# Altium schematic sheet Illustrations.SchDoc: Illustrations
size A3; ApprovedBy: LD Stanton; Author: LD Stanton; CompanyName: University of Cape Town; DrawnBy: Lawrence Stanton; Engineer: Lawrence Stanton; Organization: University of Cape Town; Address1: Department of Electrical Engineering; Address2: Rondebosch; Address3: Cape Town; Address4: South Africa 7701; DocumentNumber: 1; SheetNumber: 1; SheetTotal: 1
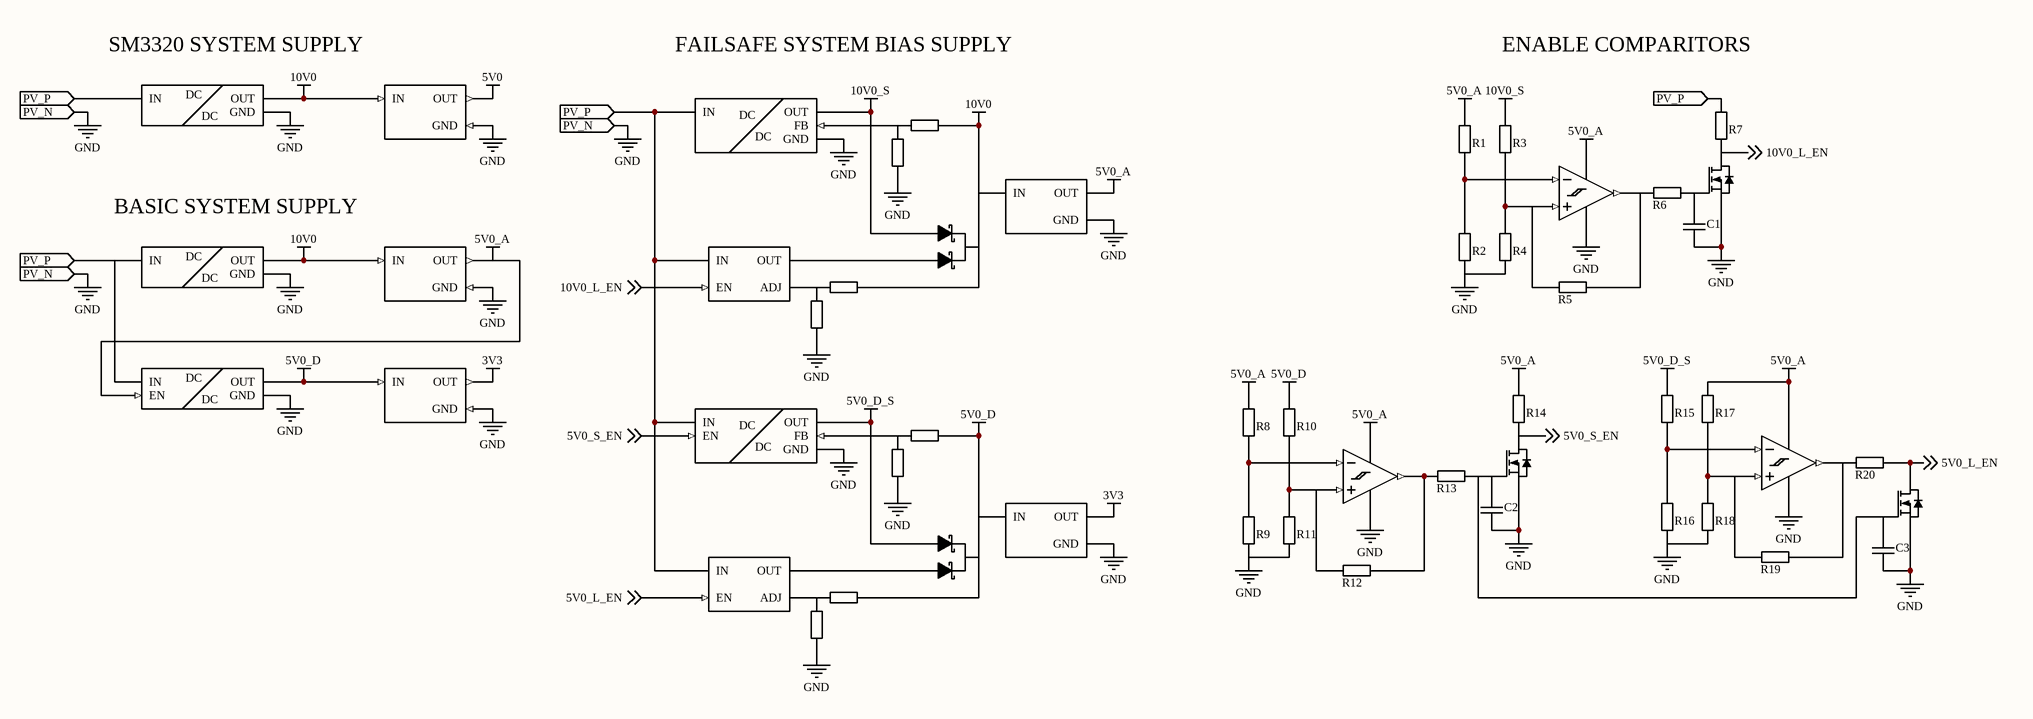
[diagram p0: Illustrations.SchDoc]

## Parts
(Parts that share a designator on the sheet are numbered #1, #2 ... from top to bottom, then left to right.)
C1  Capacitor Non-Polarised Illustration  (value not drawn)  (graphical)
C2  Capacitor Non-Polarised Illustration  (value not drawn)  (graphical)
C3  Capacitor Non-Polarised Illustration  (value not drawn)  (graphical)
D?#1  Schottky Dual Common Cathode Illustration  (value not drawn)  (graphical)
D?#2  Schottky Dual Common Cathode Illustration  (value not drawn)  (graphical)
Q?#1  MOSFET N-Channel Illustration  (value not drawn)  (graphical)
Q?#2  MOSFET N-Channel Illustration  (value not drawn)  (graphical)
Q?#3  MOSFET N-Channel Illustration  (value not drawn)  (graphical)
R1  Resistor Box Illustration  (value not drawn)  (graphical)
R2  Resistor Box Illustration  (value not drawn)  (graphical)
R3  Resistor Box Illustration  (value not drawn)  (graphical)
R4  Resistor Box Illustration  (value not drawn)  (graphical)
R5  Resistor Box Illustration  (value not drawn)  (graphical)
R6  Resistor Box Illustration  (value not drawn)  (graphical)
R7  Resistor Box Illustration  (value not drawn)  (graphical)
R8  Resistor Box Illustration  (value not drawn)  (graphical)
R9  Resistor Box Illustration  (value not drawn)  (graphical)
R10  Resistor Box Illustration  (value not drawn)  (graphical)
R11  Resistor Box Illustration  (value not drawn)  (graphical)
R12  Resistor Box Illustration  (value not drawn)  (graphical)
R13  Resistor Box Illustration  (value not drawn)  (graphical)
R14  Resistor Box Illustration  (value not drawn)  (graphical)
R15  Resistor Box Illustration  (value not drawn)  (graphical)
R16  Resistor Box Illustration  (value not drawn)  (graphical)
R17  Resistor Box Illustration  (value not drawn)  (graphical)
R18  Resistor Box Illustration  (value not drawn)  (graphical)
R19  Resistor Box Illustration  (value not drawn)  (graphical)
R20  Resistor Box Illustration  (value not drawn)  (graphical)
R?#1  Resistor Box Illustration  (value not drawn)  (graphical)
R?#2  Resistor Box Illustration  (value not drawn)  (graphical)
R?#3  Resistor Box Illustration  (value not drawn)  (graphical)
R?#4  Resistor Box Illustration  (value not drawn)  (graphical)
R?#5  Resistor Box Illustration  (value not drawn)  (graphical)
R?#6  Resistor Box Illustration  (value not drawn)  (graphical)
R?#7  Resistor Box Illustration  (value not drawn)  (graphical)
R?#8  Resistor Box Illustration  (value not drawn)  (graphical)
U?#1  DC/DC Nonisolated Enable Illustration  (value not drawn)  (graphical)
U?#2  Linear Regulator Fixed Illustration  (value not drawn)  (graphical)
U?#3  DC/DC Nonisolated Feedback Illustration  (value not drawn)  (graphical)
U?#4  Comparator Powered Illustration  (value not drawn)  (graphical)
U?#5  Linear Regulator Fixed Illustration  (value not drawn)  (graphical)
U?#6  DC/DC Nonisolated Enable Illustration  (value not drawn)  (graphical)
U?#7  Linear Regulator Fixed Illustration  (value not drawn)  (graphical)
U?#8  Linear Regulator Adjustible Enable Illustration  (value not drawn)  (graphical)
U?#9  DC/DC Nonisolated Enable Illustration  (value not drawn)  (graphical)
U?#10  Linear Regulator Fixed Illustration  (value not drawn)  (graphical)
U?#11  DC/DC Nonisolated Feedback Enable Illustration  (value not drawn)  (graphical)
U?#12  Comparator Powered Illustration  (value not drawn)  (graphical)
U?#13  Comparator Powered Illustration  (value not drawn)  (graphical)
U?#14  Linear Regulator Fixed Illustration  (value not drawn)  (graphical)
U?#15  Linear Regulator Adjustible Enable Illustration  (value not drawn)  (graphical)

## Ports
PV_N (in), PV_P (in)

## Nets
3V3: U?#10.3(OUT) U?#14.3(OUT)
5V0: U?#2.3(OUT)
5V0_A: R1.1 R8.1 R14.2 R17.1 U?#4.5(VCC) U?#5.3(OUT) U?#7.3(OUT) U?#9.4(EN) U?#12.5(VCC) U?#13.5(VCC)
5V0_D: D?#2.3(K) R10.1 R?#5.2 R?#7.2 U?#9.2(OUT) U?#10.1(IN) U?#14.1(IN)
5V0_D_S: D?#2.1(A1) R15.1 U?#11.2(OUT)
10V0: D?#1.3(K) R?#1.2 R?#3.2 U?#1.3(OUT) U?#2.1(IN) U?#5.1(IN) U?#6.3(OUT) U?#7.1(IN)
10V0_S: D?#1.1(A1) R3.1 U?#3.2(OUT)
GND: C1.2 C2.2 C3.2 Q?#1.2(S) Q?#2.2(S) Q?#3.2(S) R2.2 R4.2 R9.2 R11.2 R16.2 R18.2 R?#2.2 R?#4.2 R?#6.2 R?#8.2 U?#1.4(GND) U?#2.2(GND) U?#3.3(GND) U?#4.2(GND) U?#5.2(GND) U?#6.4(GND) U?#7.2(GND) U?#9.3(GND) U?#10.2(GND) U?#11.3(GND) U?#12.2(GND) U?#13.2(GND) U?#14.2(GND) ; port PV_N
5V0_L_EN: Q?#3.3(D) R20.2 U?#15.4(EN) ; off-sheet 5V0_L_EN
5V0_S_EN: Q?#2.3(D) R14.1 U?#11.4(EN) ; off-sheet 5V0_S_EN
10V0_L_EN: Q?#1.3(D) R7.1 U?#8.4(EN) ; off-sheet 10V0_L_EN
PV_P: R7.2 U?#1.1(IN) U?#3.1(IN) U?#6.1(IN) U?#8.1(IN) U?#9.1(IN) U?#11.1(IN) U?#15.1(IN) ; port PV_P
NetC1_1: C1.1 Q?#1.1(G) R6.2
NetC2_1: C2.1 C3.1 Q?#2.1(G) Q?#3.1(G) R13.2
NetD?#1_2: D?#1.2(A2) U?#8.3(OUT)
NetD?#2_2: D?#2.2(A2) U?#15.3(OUT)
NetR1_2: R1.2 R2.1 U?#4.3(1IN-)
NetR3_2: R3.2 R4.1 R5.1 U?#4.1(1IN+)
NetR5_2: R5.2 R6.1 U?#4.4(OUT)
NetR8_2: R8.2 R9.1 U?#13.3(1IN-)
NetR10_2: R10.2 R11.1 R12.1 U?#13.1(1IN+)
NetR12_2: R12.2 R13.1 U?#13.4(OUT)
NetR15_2: R15.2 R16.1 U?#12.3(1IN-)
NetR17_2: R17.2 R18.1 R19.1 U?#12.1(1IN+)
NetR19_2: R19.2 R20.1 U?#12.4(OUT)
NetR?#1_1: R?#1.1 R?#2.1 U?#3.4(FB)
NetR?#3_1: R?#3.1 R?#4.1 U?#8.2(ADJ)
NetR?#5_1: R?#5.1 R?#6.1 U?#11.5(FB)
NetR?#7_1: R?#7.1 R?#8.1 U?#15.2(ADJ)

## Notes on the sheet
- (near U?#1) SM3320 SYSTEM SUPPLY
- FAILSAFE SYSTEM BIAS SUPPLY
- ENABLE COMPARITORS
- (near U?#6) BASIC SYSTEM SUPPLY
- Size:
- Date:
- A4
- Number:
- Time:
- Revision:
- Sheet
- of
- File:
- Author:
- (in symbol CMP-00058-3) DC
- (in symbol CMP-00059-1) DC
- (in symbol CMP-00061-1) DC
- (in symbol CMP-00062-1) DC

## Library data of the parts
C1-C3 = CMP-000003-10: Non-Polarised Capacitor for Illustration.; Value: 0F; Tolerance: ±0%; Temperature Coefficient: ±0ppm/K; Placement: CRITICAL; Voltage: 0V; Package: 0000; Temperature: -0 - 0°C
D?#1 D?#2 = CMP-00060-1: Common Cathode Schottky Diode Pair for Ilustration; Forward Voltage: 0V0; Placement: CRITICAL; Forward Current: 0A0; Blocking Voltage: 0V0; Temperature: -0 - 0°C
Q?#1-Q?#3 = CMP-000008-5: N-Channel MOSFET 3-Terminal for Illustration; Current: 0A; Gate Threshold Voltage: 0V; Placement: CRITICAL; Temperature: -0 - 0°C; Gate-Source Voltage: 0V; Drain-Source Voltage: 0V
R1-R20 R?#1-R?#8 = CMP-010-000360-14: Resistor for Illustration. Box Symbol.; Value: 0K0; Working Voltage: 0V; Power: 0W; Placement: CRITICAL; Tolerance: ±0%; Temperature Coefficient: ±0ppm/K; Package: 0000; Temperature: -0 - 0°C
U?#1 U?#6 = CMP-00059-1: Nonisolated DC/DC Converter with Enable for Illustration; Placement: CRITICAL
U?#2 U?#7 U?#10 = CMP-00057-1: Fixed Linear Regulator for Illustration; Placement: CRITICAL
U?#3 = CMP-00062-1: Nonisolated DC/DC Converter with Feedback for Illustration; Placement: CRITICAL
U?#4 U?#12 U?#13 = CMP-00063-3: Comparator with Power Pins for Illustration; Placement: CRITICAL; Temperature: -0 - 0°C
U?#5 U?#14 = CMP-00057-3: Fixed Linear Regulator for Illustration; Placement: CRITICAL
U?#8 U?#15 = CMP-00055-3: Adjustible Linear Regulator with Enable for Illustration; Placement: CRITICAL
U?#9 = CMP-00058-3: Nonisolated DC/DC Converter with Enable for Illustration; Placement: CRITICAL
U?#11 = CMP-00061-1: Nonisolated DC/DC Converter with Feedback and Enable for Illustration; Placement: CRITICAL